# EAGLE design pic_k42 (EAGLE 9.3.0)
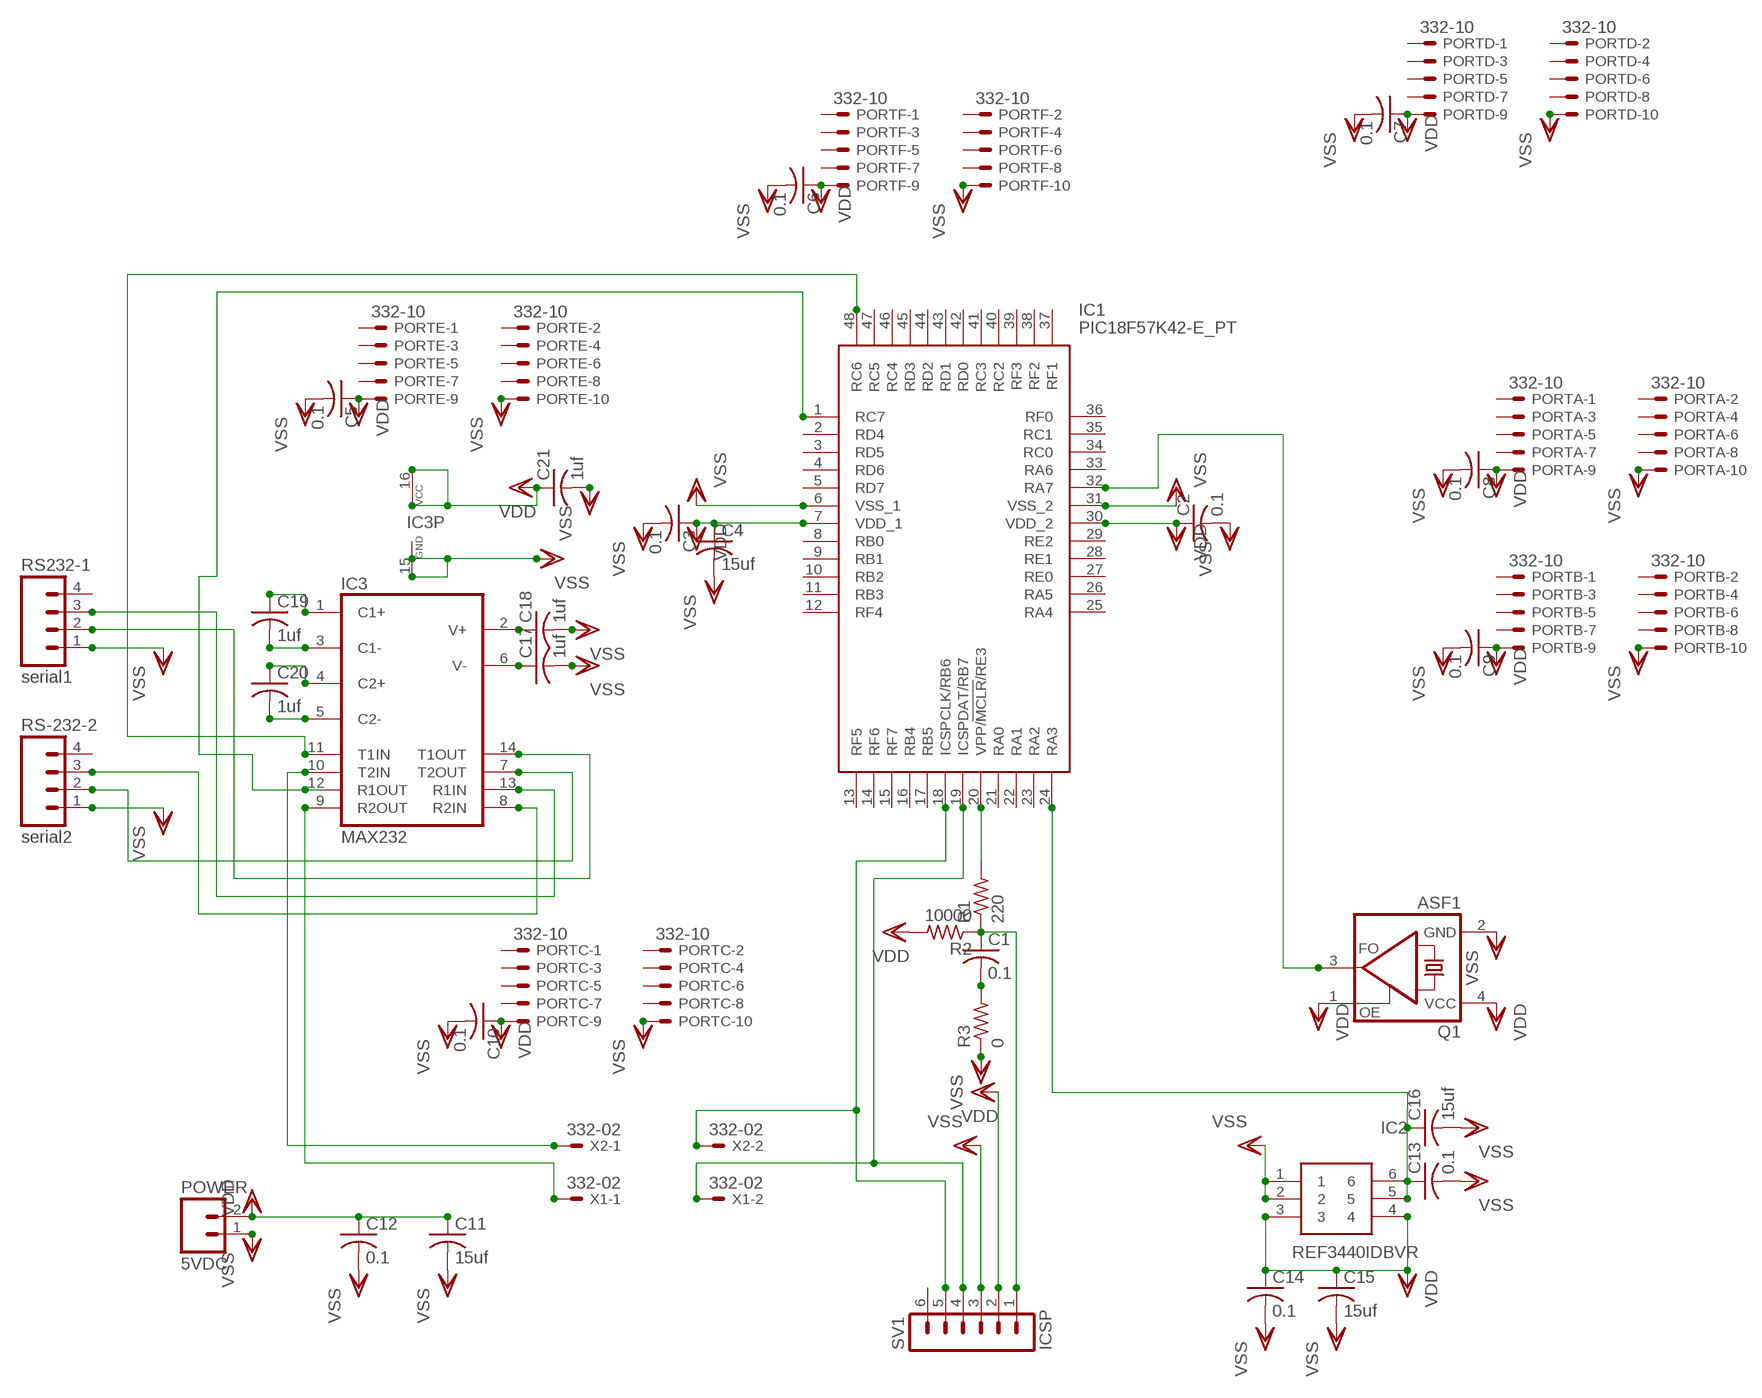
[diagram p0: schematic, sheet 1]

## Parts
C1  0.1  C-USC1206  [C1206]
C2  0.1  C-USC1206  [C1206]
C3  0.1  C-USC1206  [C1206]
C4  15uf  C-USC1206  [C1206]
C5  0.1  C-USC1206  [C1206]
C6  0.1  C-USC1206  [C1206]
C7  0.1  C-USC1206  [C1206]
C8  0.1  C-USC1206  [C1206]
C9  0.1  C-USC1206  [C1206]
C10  0.1  C-USC1206  [C1206]
C11  15uf  C-USC1206  [C1206]
C12  0.1  C-USC1206  [C1206]
C13  0.1  C-USC1206  [C1206]
C14  0.1  C-USC1206  [C1206]
C15  15uf  C-USC1206  [C1206]
C16  15uf  C-USC1206  [C1206]
C17  1uf  C-USC0805  [C0805]
C18  1uf  C-USC0805  [C0805]
C19  1uf  C-USC0805  [C0805]
C20  1uf  C-USC0805  [C0805]
C21  1uf  C-USC0805  [C0805]
IC1  PIC18F57K42-E_PT  [QFP50P900X900X120-48N]
IC2  REF3440IDBVR  [SOP95P280X145-6N]
IC3  MAX232  [DIL16]
PORTA  332-10  [332-10]
PORTB  332-10  [332-10]
PORTC  332-10  [332-10]
PORTD  332-10  [332-10]
PORTE  332-10  [332-10]
PORTF  332-10  [332-10]
POWER  5VDC  M02  [02P]
Q1  ASF1  [ASF]
R1  220  R-US_R1206  [R1206]
R2  10000  R-US_R1206  [R1206]
R3  0  R-US_R1206  [R1206]
RS232-1  serial1  M04  [04P]
RS-232-2  serial2  M04  [04P]
SV1  ICSP  MA06-1  [MA06-1]
X1  332-02  [332-02]
X2  332-02  [332-02]

## Nets
N$1: C1.1 R1.1 R2.1 SV1.1
N$2: IC1.20(VPP/!MCLR!/RE3) R1.2
N$3: C1.2 R3.2
N$4: IC1.32(RA7) Q1.3(FO)
N$5: C17.1 IC3.6(V-)
N$6: IC1.19(ICSPDAT/RB7) SV1.4 X1.2
N$7: IC1.18(ICSPCLK/RB6) SV1.5 X2.2
N$8: C13.1 C16.1 IC1.24(RA3) IC2.5 IC2.6
N$9: C18.1 IC3.2(V+)
N$10: C19.1 IC3.1(C1+)
N$11: C20.1 IC3.4(C2+)
N$12: C20.2 IC3.5(C2-)
N$13: C19.2 IC3.3(C1-)
N$14: IC3.14(T1OUT) RS232-1.2
N$15: IC3.7(T2OUT) RS-232-2.2
N$16: IC3.13(R1IN) RS232-1.3
N$17: IC3.8(R2IN) RS-232-2.3
N$18: IC1.1(RC7) IC3.12(R1OUT)
N$19: IC3.9(R2OUT) X1.1
N$20: IC1.48(RC6) IC3.11(T1IN)
N$22: IC3.10(T2IN) X2.1
VDD: C2.1 C3.1 C4.1 C5.1 C6.1 C7.1 C8.1 C9.1 C10.1 C11.1 C12.1 C14.1 C15.1 C21.1 IC1.7(VDD_1) IC1.30(VDD_2) IC2.3 IC2.4 IC3.16(VCC) PORTA.9 PORTB.9 PORTC.9 PORTD.9 PORTE.9 PORTF.9 POWER.2 Q1.1(OE) Q1.4(VCC) R2.2 SV1.2
VSS: C2.2 C3.2 C4.2 C5.2 C6.2 C7.2 C8.2 C9.2 C10.2 C11.2 C12.2 C13.2 C14.2 C15.2 C16.2 C17.2 C18.2 C21.2 IC1.6(VSS_1) IC1.31(VSS_2) IC2.1 IC2.2 IC3.15(GND) PORTA.10 PORTB.10 PORTC.10 PORTD.10 PORTE.10 PORTF.10 POWER.1 Q1.2(GND) R3.1 RS232-1.1 RS-232-2.1 SV1.3
Unconnected: IC1.2(RD4) IC1.3(RD5) IC1.4(RD6) IC1.5(RD7) IC1.8(RB0) IC1.9(RB1) IC1.10(RB2) IC1.11(RB3) IC1.12(RF4) IC1.13(RF5) IC1.14(RF6) IC1.15(RF7) IC1.16(RB4) IC1.17(RB5) IC1.21(RA0) IC1.22(RA1) IC1.23(RA2) IC1.25(RA4) IC1.26(RA5) IC1.27(RE0) IC1.28(RE1) IC1.29(RE2) IC1.33(RA6) IC1.34(RC0) IC1.35(RC1) IC1.36(RF0) IC1.37(RF1) IC1.38(RF2) IC1.39(RF3) IC1.40(RC2) IC1.41(RC3) IC1.42(RD0) IC1.43(RD1) IC1.44(RD2) IC1.45(RD3) IC1.46(RC4) IC1.47(RC5) PORTA.1 PORTA.2 PORTA.3 PORTA.4 PORTA.5 PORTA.6 PORTA.7 PORTA.8 PORTB.1 PORTB.2 PORTB.3 PORTB.4 PORTB.5 PORTB.6 PORTB.7 PORTB.8 PORTC.1 PORTC.2 PORTC.3 PORTC.4 PORTC.5 PORTC.6 PORTC.7 PORTC.8 PORTD.1 PORTD.2 PORTD.3 PORTD.4 PORTD.5 PORTD.6 PORTD.7 PORTD.8 PORTE.1 PORTE.2 PORTE.3 PORTE.4 PORTE.5 PORTE.6 PORTE.7 PORTE.8 PORTF.1 PORTF.2 PORTF.3 PORTF.4 PORTF.5 PORTF.6 PORTF.7 PORTF.8 RS232-1.4 RS-232-2.4 SV1.6

## Library data of the parts
C1-C21 = rcl:C-US: CAPACITOR, American symbol; SPICEPREFIX: C
IC1 = SamacSys_Parts:PIC18F57K42-E_PT: 8-bit Microcontrollers - MCU 128KB Flash, 8KB RAM, 256B EEPROM, 12-bit ADC2, Vector Interrupts, DMA, MAP, DIA, DAC, Comp, PWM, CWG, HLT, WWDT, SCAN/CRC, ZCD, PPS, EUSART, SPI/I2C, IDLE/DOZE/PMD Source: Datasheet <https://componentsearchengine.com/Datasheets/1/PIC18F57K42-E_PT.pdf>; DESCRIPTION: 8-bit Microcontrollers - MCU 128KB Flash, 8KB RAM, 256B EEPROM, 12-bit ADC2, Vector Interrupts, DMA, MAP, DIA, DAC, Comp, PWM, CWG, HLT, WWDT, SCAN/CRC, ZCD, PPS, EUSART, SPI/I2C, IDLE/DOZE/PMD; HEIGHT: 1.2mm; MANUFACTURER_NAME: Microchip; MANUFACTURER_PART_NUMBER: PIC18F57K42-E/PT; MOUSER_PART_NUMBER: 579-PIC18F57K42-E/PT
IC2 = SamacSys_Parts:REF3440IDBVR: 4.1V Low-Drift Low-Power Small-Footprint Series Voltage Reference Source: Datasheet <http://www.ti.com/lit/gpn/ref3440>; DESCRIPTION: 4.1V Low-Drift Low-Power Small-Footprint Series Voltage Reference; HEIGHT: 1.45mm; MANUFACTURER_NAME: Texas Instruments; MANUFACTURER_PART_NUMBER: REF3440IDBVR
IC3 = maxim:MAX232: RS232 TRANSCEIVER; MF: MAXIM; MPN: MAX232ACPE+; OC_FARNELL: 9723773; OC_NEWARK: 68K4544
PORTA PORTB PORTC PORTD PORTE PORTF = con-garry:332-10: 10 Pin - 2mm Dual Row Source: www.mpe-connector.de / garry_shortform_2012.pdf
POWER = con-amp-quick:M02: AMP QUICK CONNECTOR; OC_FARNELL: unknown; OC_NEWARK: unknown
Q1 = crystal:ASF*: CRYSTAL CLOCK OSCILLATORS 5.0 Vdc or 3.3 Vdc - LOW PROFILE ULTRA MINIATURE CERAMIC SURFACE MOUNT Source: http://www.abracon.com/Oscillators/asf1-L-L1.pdf; OC_FARNELL: unknown; OC_NEWARK: unknown
R1-R3 = rcl:R-US_: RESISTOR, American symbol; SPICEPREFIX: R
RS232-1 RS-232-2 = con-amp-quick:M04: AMP QUICK CONNECTOR; OC_FARNELL: unknown; OC_NEWARK: unknown
SV1 = con-lstb:MA06-1: PIN HEADER; OC_FARNELL: unknown; OC_NEWARK: unknown
X1 X2 = con-garry:332-02: 2 Pin - 2mm Dual Row Source: www.mpe-connector.de / garry_shortform_2012.pdf

## Board
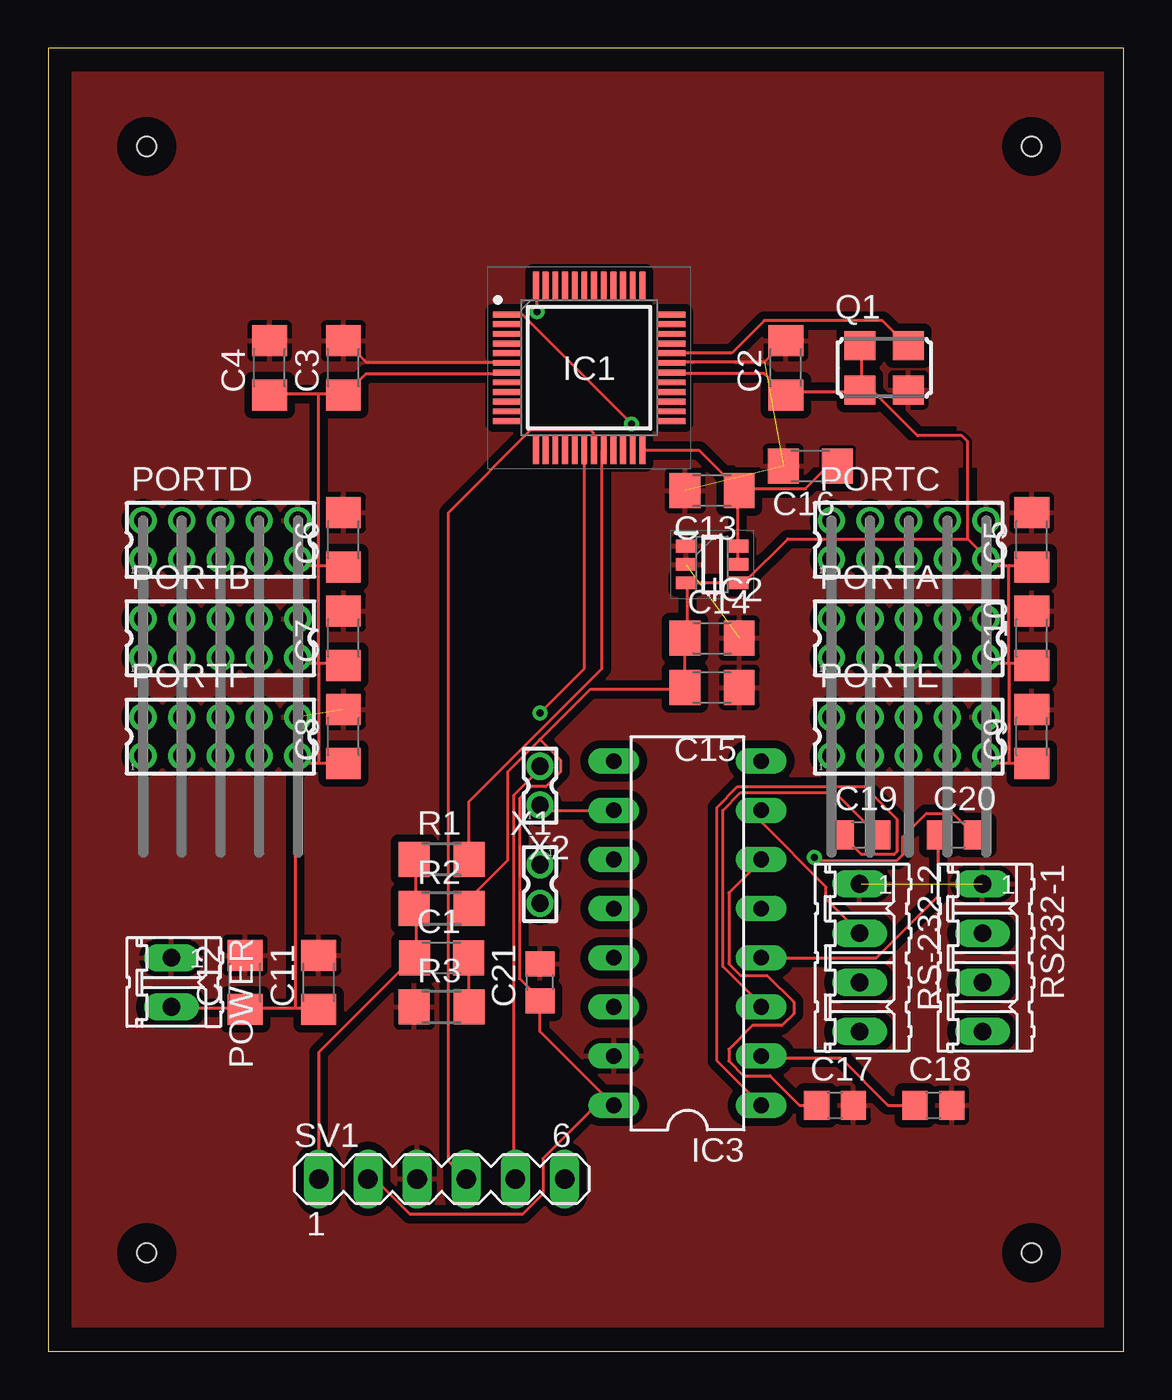
[diagram p1: board, top side]
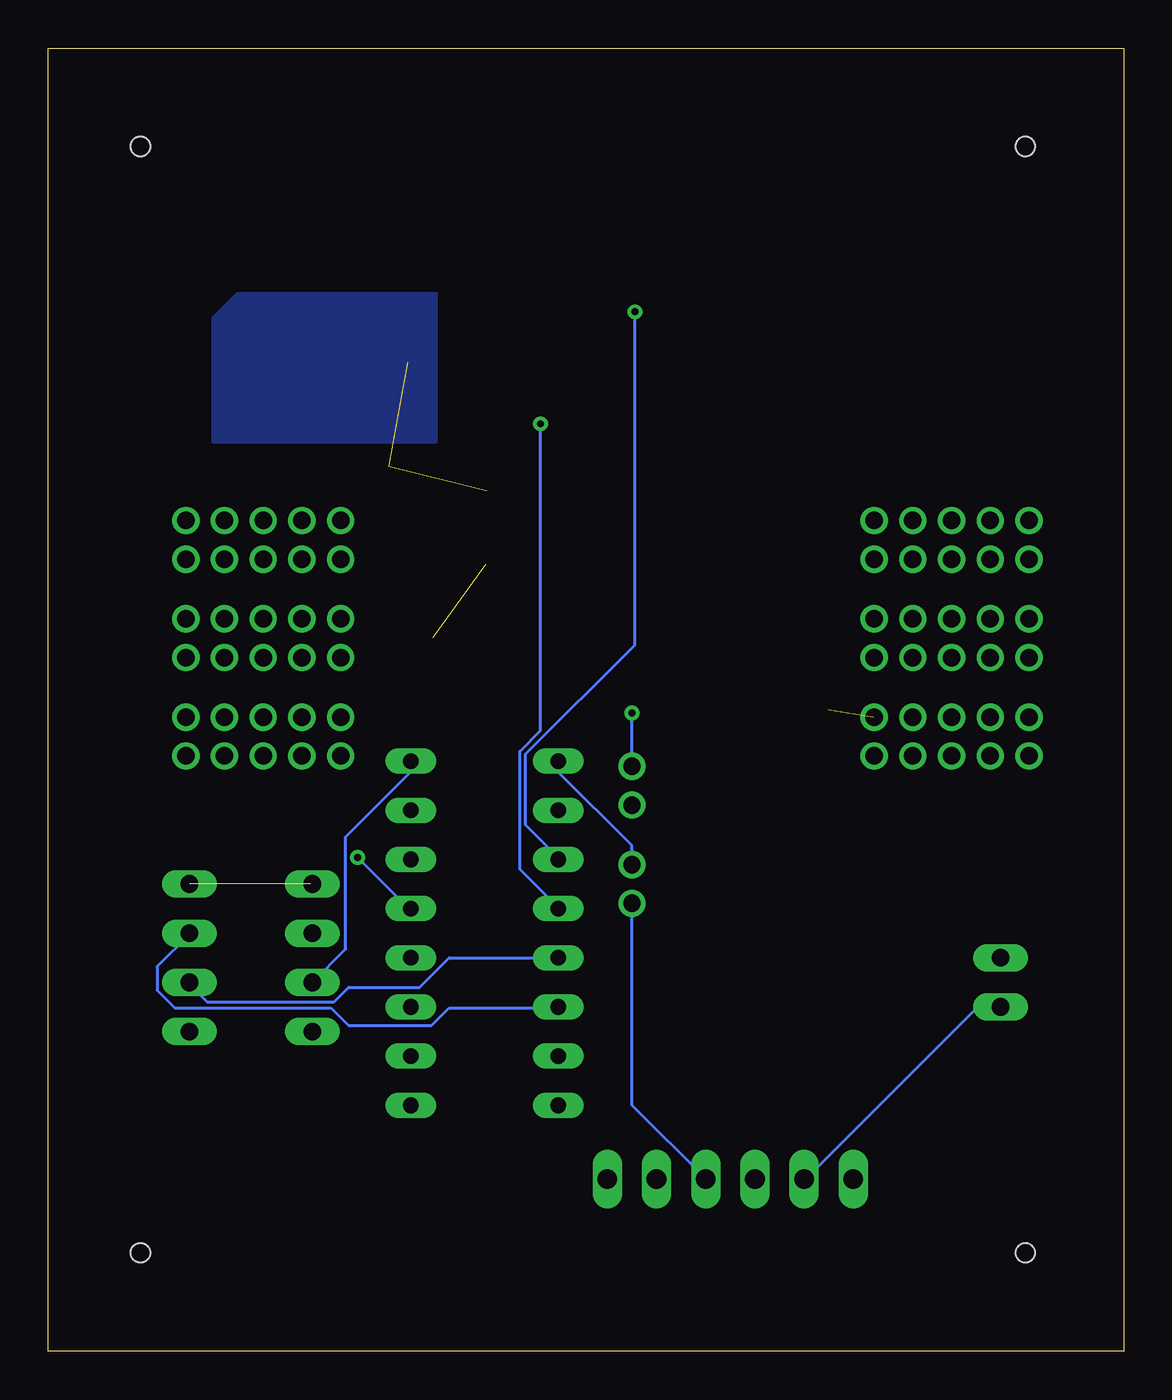
[diagram p2: board, bottom side, seen from below]

Size 55.55 x 67.3 mm. Coordinates in mm from the lower left corner, seen from the top.
Outline: 0,0 55.55,0 55.55,67.3 0,67.3 0,0
Copper layers (1*16): Top 0.035mm / dielectric 1.5mm / Bottom 0.035mm
Design rules "default": minimum track width 6mil, minimum drill 0.35mm, track to track 6mil, track to pad 6mil, pad to pad 6mil, via to via 6mil, smd to smd 6mil, copper to edge 40mil, drill to drill 6mil, minimum pad ring 10mil, minimum via ring 8mil, stop-mask expansion 4mil, vias tented up to drill 0mil, thermal gap 10mil
Holes 1 mm at 5.08,62.23 50.8,62.23 50.8,5.08 5.08,5.08

### Footprints (pad centres in the part's own frame; a part is rotated, then mirrored left to right if it is on the bottom)
C1206 = smd 1.6 x 1.8: 1 -1.4,0; 2 1.4,0
C0805 = smd 1.3 x 1.5: 1 -0.95,0; 2 0.95,0
QFP50P900X900X120-48N = smd 1.475 x 0.3: 1 -4.238,2.75; 2 -4.238,2.25; 3 -4.238,1.75; 4 -4.238,1.25; 5 -4.238,0.75; 6 -4.238,0.25; 7 -4.238,-0.25; 8 -4.238,-0.75; 9 -4.238,-1.25; 10 -4.238,-1.75; 11 -4.238,-2.25; 12 -4.238,-2.75; 25 4.238,-2.75; 26 4.238,-2.25; 27 4.238,-1.75; 28 4.238,-1.25; 29 4.238,-0.75; 30 4.238,-0.25; 31 4.238,0.25; 32 4.238,0.75; 33 4.238,1.25; 34 4.238,1.75; 35 4.238,2.25; 36 4.238,2.75 | smd 0.3 x 1.475: 13 -2.75,-4.238; 14 -2.25,-4.238; 15 -1.75,-4.238; 16 -1.25,-4.238; 17 -0.75,-4.238; 18 -0.25,-4.238; 19 0.25,-4.238; 20 0.75,-4.238; 21 1.25,-4.238; 22 1.75,-4.238; 23 2.25,-4.238; 24 2.75,-4.238; 37 2.75,4.238; 38 2.25,4.238; 39 1.75,4.238; 40 1.25,4.238; 41 0.75,4.238; 42 0.25,4.238; 43 -0.25,4.238; 44 -0.75,4.238; 45 -1.25,4.238; 46 -1.75,4.238; 47 -2.25,4.238; 48 -2.75,4.238
SOP95P280X145-6N = smd 1.075 x 0.65: 1 -1.338,0.95; 2 -1.338,0; 3 -1.338,-0.95; 4 1.338,-0.95; 5 1.338,0; 6 1.338,0.95
DIL16 = drill 0.813 long: 1 -8.89,-3.81; 2 -6.35,-3.81; 3 -3.81,-3.81; 4 -1.27,-3.81; 5 1.27,-3.81; 6 3.81,-3.81; 7 6.35,-3.81; 8 8.89,-3.81; 9 8.89,3.81; 10 6.35,3.81; 11 3.81,3.81; 12 1.27,3.81; 13 -1.27,3.81; 14 -3.81,3.81; 15 -6.35,3.81; 16 -8.89,3.81
332-10 = drill 0.9 pad 1.27: 1 -4,-1; 2 -4,1; 3 -2,-1; 4 -2,1; 5 0,-1; 6 0,1; 7 2,-1; 8 2,1; 9 4,-1; 10 4,1
02P = drill 0.914 long: 1 -1.27,0; 2 1.27,0
ASF = smd 1.6 x 1.5: 1 -1.25,-1.15; 2 1.25,-1.15; 3 1.25,1.15; 4 -1.25,1.15
R1206 = smd 1.6 x 1.803: 1 -1.422,0; 2 1.422,0
04P = drill 0.914 long: 1 -3.81,0; 2 -1.27,0; 3 1.27,0; 4 3.81,0
MA06-1 = drill 1.016 long: 1 -6.35,0; 2 -3.81,0; 3 -1.27,0; 4 1.27,0; 5 3.81,0; 6 6.35,0
332-02 = drill 0.9 pad 1.27: 1 0,-1; 2 0,1

### Placement (x,y rotation side)
C1  20.32,20.32 0 top
C2  38.1,50.8 90 top
C3  15.24,50.8 90 top
C4  11.43,50.8 90 top
C5  50.8,41.91 90 top
C6  15.24,41.91 90 top
C7  15.24,36.83 90 top
C8  15.24,31.75 90 top
C9  50.8,31.75 90 top
C10  50.8,36.83 90 top
C11  13.97,19.05 90 top
C12  10.16,19.05 90 top
C13  34.29,44.45 180 top
C14  34.29,36.83 0 top
C15  34.29,34.29 0 top
C16  39.37,45.72 180 top
C17  40.64,12.7 0 top
C18  45.72,12.7 0 top
C19  41.91,26.67 0 top
C20  46.99,26.67 0 top
C21  25.4,19.05 90 top
IC1  27.94,50.8 0 top
IC2  34.29,40.64 0 top
IC3  33.02,21.59 90 top
PORTA  44.45,36.83 0 top
PORTB  8.89,36.83 0 top
PORTC  44.45,41.91 0 top
PORTD  8.89,41.91 0 top
PORTE  44.45,31.75 0 top
PORTF  8.89,31.75 0 top
POWER  6.35,19.05 270 top
Q1  43.18,50.8 0 top
R1  20.32,25.4 0 top
R2  20.32,22.86 0 top
R3  20.32,17.78 0 top
RS232-1  48.26,20.32 270 top
RS-232-2  41.91,20.32 270 top
SV1  20.32,8.89 0 top
X1  25.4,24.13 180 top
X2  25.4,29.21 0 top

### Tracks (layer width: path | path; a pad name or v marks a point on that pad's centre or on a via)
N$1
  Top 0.152: R1.1 19,25.35 19,22.91 R2.1 19,22.76 19,20.32 C1.1 18.85,20.32 13.97,15.44 SV1.1
N$2
  Top 0.152: IC1.20 28.6,46.53 28.6,35.25 21.74,28.4 21.74,25.5 R1.2
N$3
  Top 0.152: C1.2 21.74,20.32 21.74,17.88 R3.2
N$4
  Top 0.152: IC1.32 32.26,51.56 35.31,51.56 36.98,53.24 43.08,53.24 44.3,52.02 Q1.3
N$5
  Top 0.152: C17.1 38.81,12.7 37.29,14.22 35.92,14.22 35.15,14.99 35.15,15.6 36.37,16.82 37.9,16.82 38.51,17.42 38.51,18.03 37.14,19.41 35.76,19.41 35.15,20.02 35.15,23.67 36.83,25.35 IC3.6
N$6
  Top 0.152: SV1.4 20.68,9.8 20.68,43.33 24.94,47.6 27.99,47.6 28.14,47.45 28.14,46.69 IC1.19
  Bottom 0.152: X1.2 25.4,12.7 SV1.4
N$7  (via drill 0.35)
  Top 0.152: v25.4,32.97 27.69,35.25 27.69,46.53 IC1.18 | SV1.5 24.03,8.89 24.03,28.7 25.4,30.07 X2.2
  Bottom 0.152: X2.2 v25.4,32.97
N$8
  Top 0.152: IC2.5 35.61,40.74 35.61,41.5 IC2.6 35.61,41.66 35.61,44.4 C13.1 | IC1.24 30.73,46.53 33.63,46.53 35.61,44.55 C13.1 | C16.1 40.64,45.62 40.18,45.62 39.12,44.55 35.76,44.55 C13.1
N$9
  Top 0.152: C18.1 43.38,12.7 40.95,15.14 36.83,15.14 IC3.2
N$10
  Top 0.152: IC3.1 34.54,14.99 34.54,28.09 35.61,29.16 42.16,29.16 43.84,27.48 43.84,25.81 43.69,25.65 42.01,25.65 41.1,26.57 C19.1
N$11
  Top 0.152: IC3.4 42.77,20.32 45.97,23.52 45.97,26.57 C20.1
N$12  (via drill 0.35)
  Top 0.152: v39.57,25.5 39.73,25.35 43.84,25.35 44.15,25.65 44.15,26.57 45.36,27.79 46.74,27.79 47.8,26.72 C20.2
  Bottom 0.152: v39.57,25.5 36.83,22.76 IC3.5
N$13
  Top 0.152: C19.2 42.77,26.72 40.64,28.85 35.76,28.85 34.85,27.94 34.85,19.86 36.83,17.88 IC3.3
N$14
  Bottom 0.152: IC3.14 29.21,17.73 34.85,17.73 35.76,16.82 40.03,16.82 40.95,17.73 49.02,17.73 49.94,18.64 49.94,19.86 48.26,21.54 RS232-1.2
N$15
  Top 0.152: IC3.7 36.83,27.33 40.18,23.98 40.18,23.37 41.86,21.69 RS-232-2.2
N$16
  Bottom 0.152: IC3.13 34.85,20.32 36.37,18.8 40.03,18.8 40.79,18.03 47.35,18.03 48.26,18.95 RS232-1.3
N$17
  Bottom 0.152: IC3.8 36.83,29.92 40.18,26.57 40.18,20.78 RS-232-2.3
N$18  (via drill 0.35)
  Top 0.152: v30.12,47.9 24.49,53.54 23.72,53.54 IC1.1
  Bottom 0.152: v30.12,47.9 30.12,32.05 31.19,30.99 31.19,24.89 29.21,22.91 IC3.12
N$19
  Bottom 0.152: IC3.9 29.21,29.92 25.4,26.11 X1.1
N$20  (via drill 0.35)
  Top 0.152: v25.25,53.7 25.25,54.91 IC1.48
  Bottom 0.152: v25.25,53.7 25.25,36.47 30.89,30.84 30.89,27.18 29.21,25.5 IC3.11
N$22
  Top 0.152: IC3.10 25.55,27.94 25.4,28.09 X2.1
VDD
  Top 0.152: 10.16,17.73 6.35,17.73 POWER.2 | 10.16,17.73 12.75,17.73 | 12.75,17.73 13.97,17.73 C11.1 | 10.16,17.73 C12.1 | IC1.7 23.57,50.49 16.41,50.49 15.34,49.43 C3.1 15.19,49.43 13.97,49.43 | 13.97,49.43 11.53,49.43 C4.1 | 13.97,40.59 13.21,40.59 12.9,40.89 PORTD.9 | 13.97,40.59 15.19,40.59 C6.1 | 13.97,30.38 13.21,30.38 12.9,30.68 PORTF.9 12.75,30.68 12.75,17.73 | 13.97,30.38 15.19,30.38 C8.1 | 13.97,35.56 13.06,35.56 12.9,35.71 PORTB.9 | 13.97,35.56 15.19,35.56 C7.1 | 13.97,35.56 13.97,30.38 | 13.97,35.56 13.97,40.59 | 13.97,40.59 13.97,49.43 | Q1.1 42.01,49.73 42.01,51.87 Q1.4 | IC1.30 32.26,50.49 36.98,50.49 38.05,49.43 C2.1 38.2,49.43 38.35,49.58 41.86,49.58 Q1.1 | 49.63,40.59 48.87,40.59 48.56,40.89 PORTC.9 48.41,41.05 47.5,41.96 | 49.63,40.59 50.7,40.59 C5.1 | 49.63,30.38 48.87,30.38 48.56,30.68 PORTE.9 | 49.63,30.38 50.7,30.38 C9.1 | 49.63,35.56 48.72,35.56 48.56,35.71 PORTA.9 | 49.63,35.56 50.7,35.56 C10.1 | 49.63,35.56 49.63,30.38 | 49.63,35.56 49.63,40.59 | 47.5,41.96 47.5,46.99 47.19,47.3 44.91,47.3 42.62,49.58 42.01,49.58 Q1.1 | 28.75,13.16 25.4,16.51 C21.1 25.4,18.19 24.33,19.25 24.33,28.55 24.94,29.16 25.71,29.16 26.47,29.92 26.47,30.53 25.4,31.6 | 33.02,39.67 35.61,39.67 IC2.4 35.76,39.83 36.07,39.83 38.2,41.96 47.5,41.96 | 25.4,31.6 27.99,34.19 32.87,34.19 C15.1 32.87,34.34 32.87,36.78 C14.1 33.02,36.93 33.02,39.67 | 25.4,31.6 23.72,29.92 23.72,25.35 21.74,23.37 21.74,22.91 R2.2 | 33.02,39.67 IC2.3 | SV1.2 16.87,8.89 18.69,7.06 24.49,7.06 25.55,8.13 25.55,9.96 28.75,13.16 | 28.75,13.16 IC3.16
  Bottom 0.152: SV1.2 16.41,8.89 7.57,17.73 6.35,17.73 POWER.2
VSS  (5 unrouted)
  Top 0.152: IC1.6 23.57,51.11 16.41,51.11 15.34,52.17 C3.2 | IC1.31 32.26,51.11 36.98,51.11 38.05,52.17 C2.2 | 42.01,24.13 RS-232-2.1
  pour Top: 35.56,46.99 46.99,46.99 46.99,45.72 35.56,45.72
  pour Top: 35.56,54.61 48.26,54.61 48.26,55.88 35.56,55.88
  pour Bottom: 36.83,46.99 46.99,46.99 46.99,53.34 45.72,54.61 35.56,54.61 35.56,46.99
  pour Top: 46.99,45.72 48.26,45.72 48.26,54.61 46.99,54.61
  pour Top (isolate 0.406): 1.27,66.04 54.61,66.04 54.61,1.27 1.27,1.27